# EAGLE schematic LTC3605_VPWR_1.2V_L2 (EAGLE 6.3)
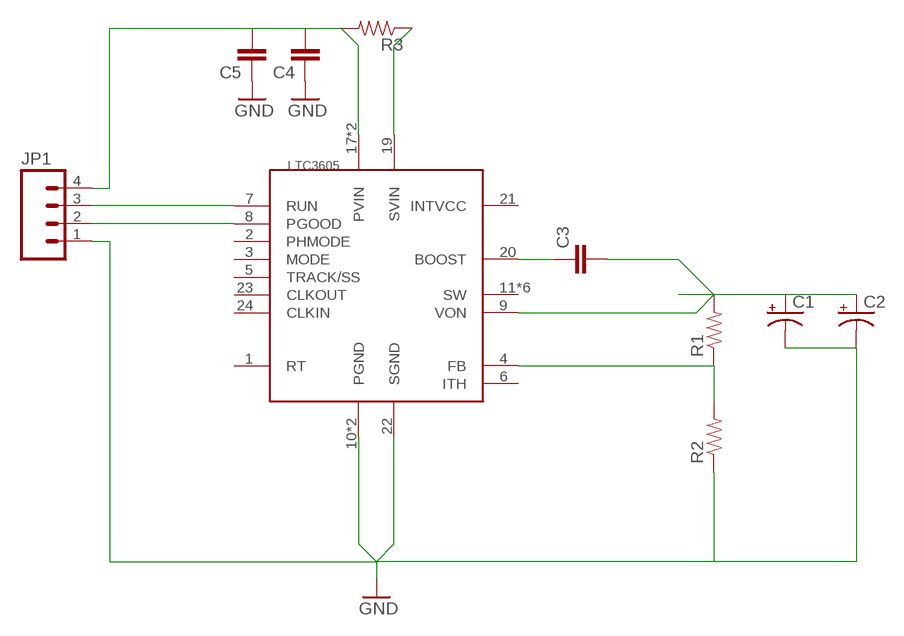
[diagram p0: schematic, sheet 1]

## Parts
C1  CAP_POL1206  [EIA3216]
C2  CAP_POL1206  [EIA3216]
C3  CAP0603-CAP  [0603-CAP]
C4  CAP0603-CAP  [0603-CAP]
C5  CAP0603-CAP  [0603-CAP]
JP1  M04LOCK  [1X04_LOCK]
R1  RESISTOR0603-RES  [0603-RES]
R2  RESISTOR0603-RES  [0603-RES]
R3  RESISTOR0603-RES  [0603-RES]
U$1  LTC3605  [QFN24]

## Nets
GND: C1.C(-) C2.C(-) C4.1 C5.1 JP1.1 R2.1 U$1.10(PGND) U$1.22(SGND) U$1.EXP(PGND)
N$1: R1.1 R2.2 U$1.4(FB)
N$3: C1.A(+) C2.A(+) C3.2 R1.2 U$1.9(VON)
N$4: C3.1 U$1.20(BOOST)
N$6: R3.1 U$1.19(SVIN)
N$9: JP1.2 U$1.8(PGOOD)
N$10: JP1.3 U$1.7(RUN)
N$11: C4.2 C5.2 JP1.4 R3.2 U$1.17(PVIN) U$1.18(PVIN)
Unconnected: U$1.1(RT) U$1.2(PHMODE) U$1.3(MODE) U$1.5(TRACK/SS) U$1.6(ITH) U$1.11(SW) U$1.12(SW) U$1.13(SW) U$1.14(SW) U$1.15(SW) U$1.16(SW) U$1.21(INTVCC) U$1.23(CLKOUT) U$1.24(CLKIN)

## Library data of the parts
C1 C2 = 1x05smd:CAP_POL: Capacitor Polarized These are standard SMD and PTH capacitors. Normally 10uF, 47uF, and 100uF in electrolytic and tantalum varieties. Always verify the external diameter of the through hole cap, it varies with capacity, voltage, and manufacturer. The EIA devices should be standard.
C3-C5 = 1x05smd:CAP: Capacitor Standard 0603 ceramic capacitor, and 0.1" leaded capacitor.
JP1 = 1x05smd:M04: Header 4 Standard 4-pin 0.1" header. Use with straight break away headers (SKU : PRT-00116), right angle break away headers (PRT-00553), swiss pins (PRT-00743), machine pins (PRT-00117), and female headers (PRT-00115). Molex polarized connector foot print use with SKU : PRT-08231 with associated crimp pins and housings.
R1-R3 = 1x05smd:RESISTOR: Resistor Basic schematic elements and footprints for 0603, 1206, and PTH 1/10th watt (small) resistors.
U$1 = Strutz Electronic Industries:LTC3605